# Altium schematic sheet Temperatures.SchDoc
size A4; SheetNumber: 4; SheetTotal: 5
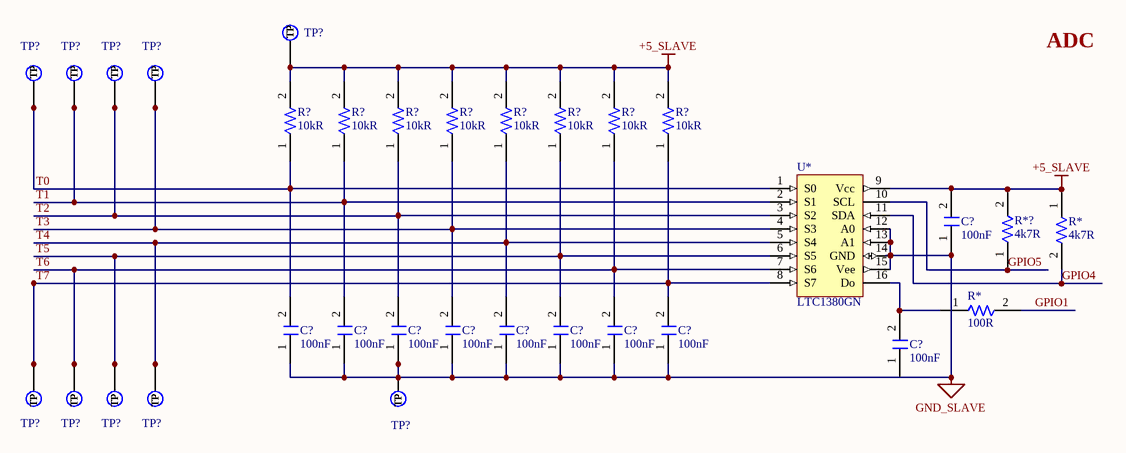
[diagram p0: Temperatures.SchDoc]

## Parts
(Parts that share a designator on the sheet are numbered #1, #2 ... from top to bottom, then left to right.)
C?#1  Capacitance: 100nF  [C0805FNPC-R]  (hidden comment: 885012207098)
C?#2  Capacitance: 100nF  [C0805FNPC-R]  (hidden comment: 885012207098)
C?#3  Capacitance: 100nF  [C0805FNPC-R]  (hidden comment: 885012207098)
C?#4  Capacitance: 100nF  [C0805FNPC-R]  (hidden comment: 885012207098)
C?#5  Capacitance: 100nF  [C0805FNPC-R]  (hidden comment: 885012207098)
C?#6  Capacitance: 100nF  [C0805FNPC-R]  (hidden comment: 885012207098)
C?#7  Capacitance: 100nF  [C0805FNPC-R]  (hidden comment: 885012207098)
C?#8  Capacitance: 100nF  [C0805FNPC-R]  (hidden comment: 885012207098)
C?#9  Capacitance: 100nF  [C0805FNPC-R]  (hidden comment: 885012207098)
C?#10  Capacitance: 100nF  [C0805FNPC-R]  (hidden comment: 885012207098)
R*#1  Resistance: 4k7R  [R0805FTK]  (hidden comment: CR0805-JW-472ELF)
R*#2  Resistance: 100R  [R0805FTK]  (hidden comment: CR0805-FX-1000ELF)
R*?  Resistance: 4k7R  [R0805FTK]  (hidden comment: CR0805-JW-472ELF)
R?#1  Resistance: 10kR  [R0805FTK]  (hidden comment: CR0805-JW-103ELF)
R?#2  Resistance: 10kR  [R0805FTK]  (hidden comment: CR0805-JW-103ELF)
R?#3  Resistance: 10kR  [R0805FTK]  (hidden comment: CR0805-JW-103ELF)
R?#4  Resistance: 10kR  [R0805FTK]  (hidden comment: CR0805-JW-103ELF)
R?#5  Resistance: 10kR  [R0805FTK]  (hidden comment: CR0805-JW-103ELF)
R?#6  Resistance: 10kR  [R0805FTK]  (hidden comment: CR0805-JW-103ELF)
R?#7  Resistance: 10kR  [R0805FTK]  (hidden comment: CR0805-JW-103ELF)
R?#8  Resistance: 10kR  [R0805FTK]  (hidden comment: CR0805-JW-103ELF)
TP?#1  TestPoint  [TestPoint]  (value not drawn)  (no BOM)
TP?#2  TestPoint  [TestPoint]  (value not drawn)  (no BOM)
TP?#3  TestPoint  [TestPoint]  (value not drawn)  (no BOM)
TP?#4  TestPoint  [TestPoint]  (value not drawn)  (no BOM)
TP?#5  TestPoint  [TestPoint]  (value not drawn)  (no BOM)
TP?#6  TestPoint  [TestPoint]  (value not drawn)  (no BOM)
TP?#7  TestPoint  [TestPoint]  (value not drawn)  (no BOM)
TP?#8  TestPoint  [TestPoint]  (value not drawn)  (no BOM)
TP?#9  TestPoint  [TestPoint]  (value not drawn)  (no BOM)
TP?#10  TestPoint  [TestPoint]  (value not drawn)  (no BOM)
U*  LTC1380GN  [LTC1380GN]

## Nets
+5_SLAVE: C?#1.2 R*#1.1 R*?.2 R?#1.2 R?#2.2 R?#3.2 R?#4.2 R?#5.2 R?#6.2 R?#7.2 R?#8.2 TP?#1.1(TP) U*.9(Vcc)
GND_SLAVE: C?#1.1 C?#2.1 C?#3.1 C?#4.1 C?#5.1 C?#6.1 C?#7.1 C?#8.1 C?#9.1 C?#10.1 TP?#10.1(TP) U*.12(A0) U*.13(A1) U*.14(GND) U*.15(Vee)
GPIO1: R*#2.2
GPIO4: R*#1.2 U*.11(SDA)
GPIO5: R*?.1 U*.10(SCL)
T0: C?#2.2 R?#1.1 TP?#2.1(TP) U*.1(S0)
T1: C?#3.2 R?#2.1 TP?#3.1(TP) U*.2(S1)
T2: C?#4.2 R?#3.1 TP?#4.1(TP) U*.3(S2)
T3: C?#5.2 R?#4.1 TP?#5.1(TP) U*.4(S3)
T4: C?#6.2 R?#5.1 TP?#9.1(TP) U*.5(S4)
T5: C?#7.2 R?#6.1 TP?#8.1(TP) U*.6(S5)
T6: C?#8.2 R?#7.1 TP?#7.1(TP) U*.7(S6)
T7: C?#9.2 R?#8.1 TP?#6.1(TP) U*.8(S7)
NetC?#10_2: C?#10.2 R*#2.1 U*.16(Do)

## Notes on the sheet
- ADC

## Library data of the parts
C?#1-C?#10 = C100n-50V-0805FNPC-X7R: Cap, 0.1ΜF, 50V, 10%, X7R, 0805; Manufacturer 1: Wurth Electronics; .Creator: DR; Supplier 1: RSComponents; Manufacturer Part Number 1: 885012207098; RoHS: Yes; Category: Ceramic Capacitors; Stock 1: 8000; Pricing 1: 100=0,10200, 500=0,07100, 2000=0,06100 (GBP); Mount: Surface Mount; Case/Package: 0805; Case Code (Metric): 2012; Case Code (Imperial): 0805; Min Operating Temperature: -55°C; Max Operating Temperature: 125°C; Packaging: Cut Tape; Voltage Rating: 50V; Dielectric: X7R; Tolerance: 10%; Voltage Rating (DC): 50V; Length: 0.079inch; Width: 0.049inch; Thickness: 0.035inch; REACH SVHC: Unknown; RoHS Compliant: Yes; ComponentLink1URL: http://www.farnell.com/datasheets/1958498.pdf?src-supplier=Farnell; ComponentLink1Description: http://www.farnell.com/datasheets/1958498.pdf?src-supplier=Farnell; ComponentLink2URL: http://www.farnell.com/datasheets/1958498.pdf?src-supplier=Element14; ComponentLink2Description: http://www.farnell.com/datasheets/1958498.pdf?src-supplier=Element14; ComponentLink3URL: https://katalog.we-online.de/pbs/datasheet/885012207098.pdf?src-supplier=Digi-Key; ComponentLink3Description: https://katalog.we-online.de/pbs/datasheet/885012207098.pdf?src-supplier=Digi-Key; ComponentLink4URL: http://www.farnell.com/datasheets/1958498.pdf?src-supplier=Newark; ComponentLink4Description: http://www.farnell.com/datasheets/1958498.pdf?src-supplier=Newark; Supplier Part Number 1: 1813493
R*#1 R*? = R4.7K-0805FTK: Res Thick Film 0805 4.7K Ohm 5% 1/8W ±200ppm/°C Molded SMD SMD Paper Tape on Plastic Reel; Manufacturer 1: Bourns; Power Rating: 125mW; Voltage Rating: 150V; .Creator: DR; Supplier 1: Arrow Electronics; Manufacturer Part Number 1: CR0805-JW-472ELF; RoHS: Yes; Category: Chip SMD Resistors; Stock 1: 3734; Pricing 1: 1=0,05590, 10=0,01670, 25=0,01290, 100=0,00840, 250=0,00830, 500=0,00690, 1000=0,00410 (USD); Mount: Surface Mount; Case/Package: 0805; Case Code (Metric): 2012; Case Code (Imperial): 0805; Contact Plating: Tin; Min Operating Temperature: -55°C; Max Operating Temperature: 155°C; Packaging: Tape and Reel; Tolerance: 5%; Package Quantity: 1; Resistor Type: Thick Film; Number of Terminations: 2; Termination: SMD/SMT; Temperature Coefficient: 200ppm/°C; Max Power Dissipation: 125mW; Voltage Rating (DC): 150V; Features: Moisture Resistant; Series: CR0805; Resistance Tolerance: 5%; Construction: Rectangular; Length: 2mm; Width: 0.049inch; Height: 0.024inch; Depth: 1.25mm; Thickness: 508um; Radiation Hardening: No; REACH SVHC: No SVHC; Military Standard: Not; RoHS Compliant: Yes; ComponentLink1URL: https://datasheet.ciiva.com/5541/chpreztr-5541593.pdf?src-supplier=Mouser; ComponentLink1Description: https://datasheet.ciiva.com/5541/chpreztr-5541593.pdf?src-supplier=Mouser; ComponentLink2URL: https://datasheet.ciiva.com/6560/chpreztr-6560073.pdf?src-supplier=Digi-Key; ComponentLink2Description: https://datasheet.ciiva.com/6560/chpreztr-6560073.pdf?src-supplier=Digi-Key; ComponentLink3URL: https://datasheet.ciiva.com/6560/chpreztr-6560074.pdf?src-supplier=Digi-Key; ComponentLink3Description: https://datasheet.ciiva.com/6560/chpreztr-6560074.pdf?src-supplier=Digi-Key; ComponentLink4URL: https://datasheet.ciiva.com/30174/159chpreztr-30174252.pdf?src-supplier=Onlinecomponents.com; ComponentLink4Description: https://datasheet.ciiva.com/30174/159chpreztr-30174252.pdf?src-supplier=Onlinecomponents.com; ComponentLink5URL: https://datasheet.ciiva.com/9122/chpreztr-9122814.pdf?src-supplier=Avnet; ComponentLink5Description: https://datasheet.ciiva.com/9122/chpreztr-9122814.pdf?src-supplier=Avnet; ComponentLink6URL: https://datasheet.ciiva.com/22713/691949-22713272.pdf?src-supplier=Element14; ComponentLink6Description: https://datasheet.ciiva.com/22713/691949-22713272.pdf?src-supplier=Element14; ComponentLink7URL: https://datasheet.ciiva.com/6560/chpreztr-6560075.pdf?src-supplier=Digi-Key; ComponentLink7Description: https://datasheet.ciiva.com/6560/chpreztr-6560075.pdf?src-supplier=Digi-Key; Supplier Part Number 1: CR0805-JW-472ELF
R*#2 = R100-0805FTK: Res Thick Film 0805 100 Ohm 1% 1/8W ±100ppm/°C Molded SMD SMD Paper Tape on Plastic Reel; Manufacturer 1: Bourns; Power Rating: 125mW; Voltage Rating: 150V; .Creator: DR; Supplier 1: Arrow Electronics; Manufacturer Part Number 1: CR0805-FX-1000ELF; RoHS: Yes; Category: Chip SMD Resistors; Stock 1: 49802; Pricing 1: 1=0,05840, 10=0,03430, 25=0,01780, 100=0,00750, 250=0,00560, 500=0,00490, 3000=0,00470 (USD); Mount: Surface Mount; Case/Package: 0805; Number of Pins: 2; Contact Plating: Tin; Case Code (Imperial): 0805; Case Code (Metric): 2012; Min Operating Temperature: -55°C; Max Operating Temperature: 155°C; Tolerance: 1%; Resistor Type: Thick Film; Temperature Coefficient: 100ppm/°C; Packaging: Tape and Reel; Package Quantity: 1; Termination: SMD/SMT; Number of Terminations: 2; Max Power Dissipation: 125mW; Voltage Rating (DC): 150V; Features: Moisture Resistant; Series: CR0805; Resistance Tolerance: 1%; Construction: Rectangular; Technology: THICK FILM; Length: 2mm; Width: 1.25mm; Height: 0.5mm; Depth: 1.25mm; Thickness: 508um; Radiation Hardening: No; REACH SVHC: No SVHC; Military Standard: Not; RoHS Compliant: Yes; ComponentLink1URL: https://datasheet.ciiva.com/11809/0900766b80fcdb72-11809178.pdf?src-supplier=RSComponents; ComponentLink1Description: https://datasheet.ciiva.com/11809/0900766b80fcdb72-11809178.pdf?src-supplier=RSComponents; ComponentLink2URL: https://datasheet.ciiva.com/6547/chpreztr-6547413.pdf?src-supplier=Digi-Key; ComponentLink2Description: https://datasheet.ciiva.com/6547/chpreztr-6547413.pdf?src-supplier=Digi-Key; ComponentLink3URL: https://datasheet.ciiva.com/6547/chpreztr-6547414.pdf?src-supplier=Digi-Key; ComponentLink3Description: https://datasheet.ciiva.com/6547/chpreztr-6547414.pdf?src-supplier=Digi-Key; ComponentLink4URL: https://datasheet.ciiva.com/6547/chpreztr-6547415.pdf?src-supplier=Digi-Key; ComponentLink4Description: https://datasheet.ciiva.com/6547/chpreztr-6547415.pdf?src-supplier=Digi-Key; ComponentLink5URL: https://datasheet.ciiva.com/9120/chpreztr-9120744.pdf?src-supplier=Avnet; ComponentLink5Description: https://datasheet.ciiva.com/9120/chpreztr-9120744.pdf?src-supplier=Avnet; Supplier Part Number 1: CR0805-FX-1000ELF
R?#1-R?#8 = R10k-0805FTK: BOURNS         CR0805-JW-103ELF            Surface Mount Chip Resistor, Thick Film, CR Series, 10 kohm, 125 mW,  5%, 150 V; Temperature Coefficient: 200ppm/°C; Power Rating: 125mW; Voltage Rating: 150V; Voltage Rating (DC): 100V; .Creator: DR; Supplier 1: Arrow Electronics; Manufacturer 1: Bourns; Manufacturer Part Number 1: CR0805-JW-103ELF; RoHS: Yes; Category: Chip SMD Resistors; Stock 1: 57566; Pricing 1: 1=0,05790, 10=0,01540, 25=0,01340, 100=0,00340 (USD); Mount: Surface Mount; Case/Package: 0805; Number of Pins: 2; Contact Plating: Tin; Case Code (Metric): 2012; Case Code (Imperial): 0805; Min Operating Temperature: -55°C; Max Operating Temperature: 155°C; Tolerance: 5%; Resistor Type: Thick Film; Package Quantity: 1; Packaging: Tape and Reel; Number of Terminations: 2; Termination: SMD/SMT; Max Power Dissipation: 125mW; Features: Moisture Resistant; Series: CR0805; Construction: Rectangular; Resistance Tolerance: 5%; Technology: THICK FILM; Length: 2mm; Width: 1.25mm; Height: 0.5mm; Depth: 1.25mm; Thickness: 508um; Radiation Hardening: No; REACH SVHC: No SVHC; Military Standard: Not; RoHS Compliant: Yes; ComponentLink1URL: https://datasheet.ciiva.com/11821/0900766b80fcdb72-11821135.pdf?src-supplier=RSComponents; ComponentLink1Description: https://datasheet.ciiva.com/11821/0900766b80fcdb72-11821135.pdf?src-supplier=RSComponents; ComponentLink2URL: https://datasheet.ciiva.com/9122/chpreztr-9122374.pdf?src-supplier=Avnet; ComponentLink2Description: https://datasheet.ciiva.com/9122/chpreztr-9122374.pdf?src-supplier=Avnet; ComponentLink3URL: https://datasheet.ciiva.com/22693/1902866-22693254.pdf?src-supplier=Element14; ComponentLink3Description: https://datasheet.ciiva.com/22693/1902866-22693254.pdf?src-supplier=Element14; ComponentLink4URL: https://datasheet.ciiva.com/7986/691949-7986187.pdf?src-supplier=Element14; ComponentLink4Description: https://datasheet.ciiva.com/7986/691949-7986187.pdf?src-supplier=Element14; ComponentLink5URL: https://datasheet.ciiva.com/30065/159chpreztr-30065976.pdf?src-supplier=Onlinecomponents.com; ComponentLink5Description: https://datasheet.ciiva.com/30065/159chpreztr-30065976.pdf?src-supplier=Onlinecomponents.com; ComponentLink6URL: https://datasheet.ciiva.com/16783/70154685-16783482.pdf?src-supplier=Allied+Electronics; ComponentLink6Description: https://datasheet.ciiva.com/16783/70154685-16783482.pdf?src-supplier=Allied+Electronics; ComponentLink7URL: https://datasheet.ciiva.com/5548/chpreztr-5548491.pdf?src-supplier=Mouser; ComponentLink7Description: https://datasheet.ciiva.com/5548/chpreztr-5548491.pdf?src-supplier=Mouser; ComponentLink8URL: https://datasheet.ciiva.com/6559/chpreztr-6559900.pdf?src-supplier=Digi-Key; ComponentLink8Description: https://datasheet.ciiva.com/6559/chpreztr-6559900.pdf?src-supplier=Digi-Key; ComponentLink9URL: https://datasheet.ciiva.com/6559/chpreztr-6559901.pdf?src-supplier=Digi-Key; ComponentLink9Description: https://datasheet.ciiva.com/6559/chpreztr-6559901.pdf?src-supplier=Digi-Key; ComponentLink10URL: https://datasheet.ciiva.com/7985/1856384-7985869.pdf?src-supplier=Element14; ComponentLink10Description: https://datasheet.ciiva.com/7985/1856384-7985869.pdf?src-supplier=Element14; ComponentLink11URL: https://datasheet.ciiva.com/48692/001055517-da-01-en-smd-wid-cr0805-jw-103elf-10k-ohm-1-8w-48692118.pdf?src-supplier=Conrad; ComponentLink11Description: https://datasheet.ciiva.com/48692/001055517-da-01-en-smd-wid-cr0805-jw-103elf-10k-ohm-1-8w-48692118.pdf?src-supplier=Conrad; Supplier Part Number 1: CR0805-JW-103ELF
TP?#1-TP?#10 = TestPoint: Test Point 1x1 mm; .Creator: GP; Category: TestPoint; .PCBcheck: GP; .SCHcheck: GP
U* = U_LTC1380GN